# Altium project HIGH_SPEEDV0.PrjPcb
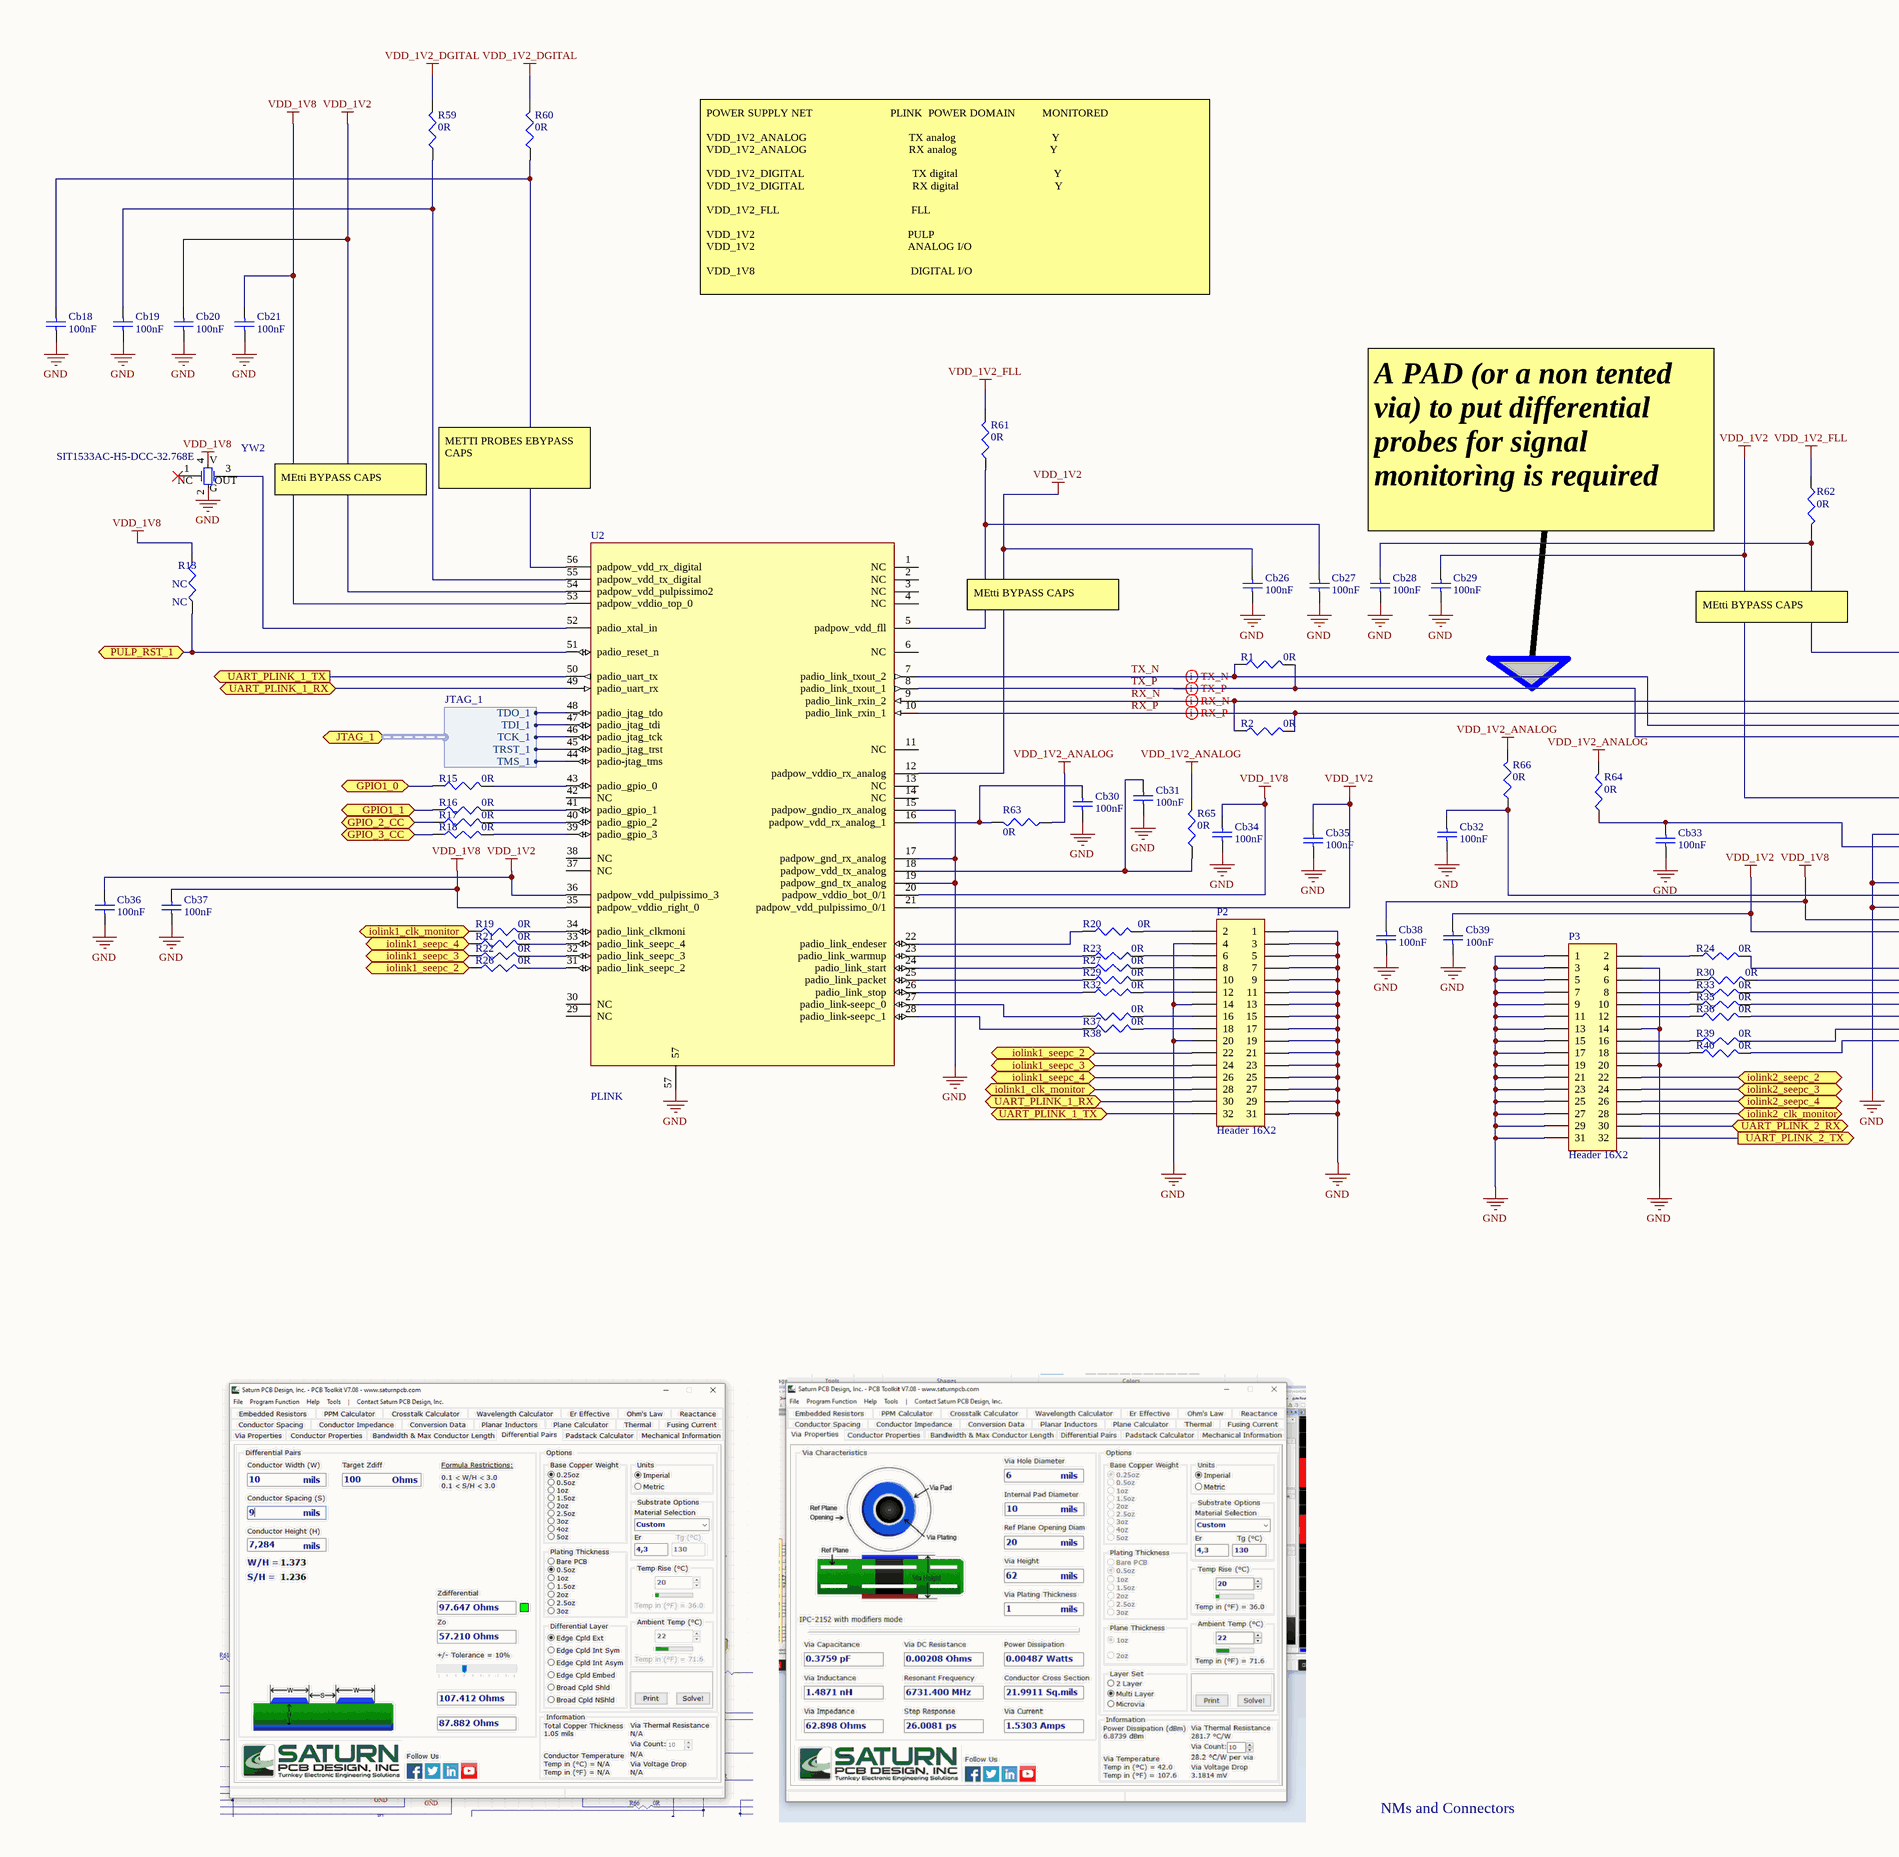
[diagram p0: HIGHSPEED_v0_NM.SchDoc, left]
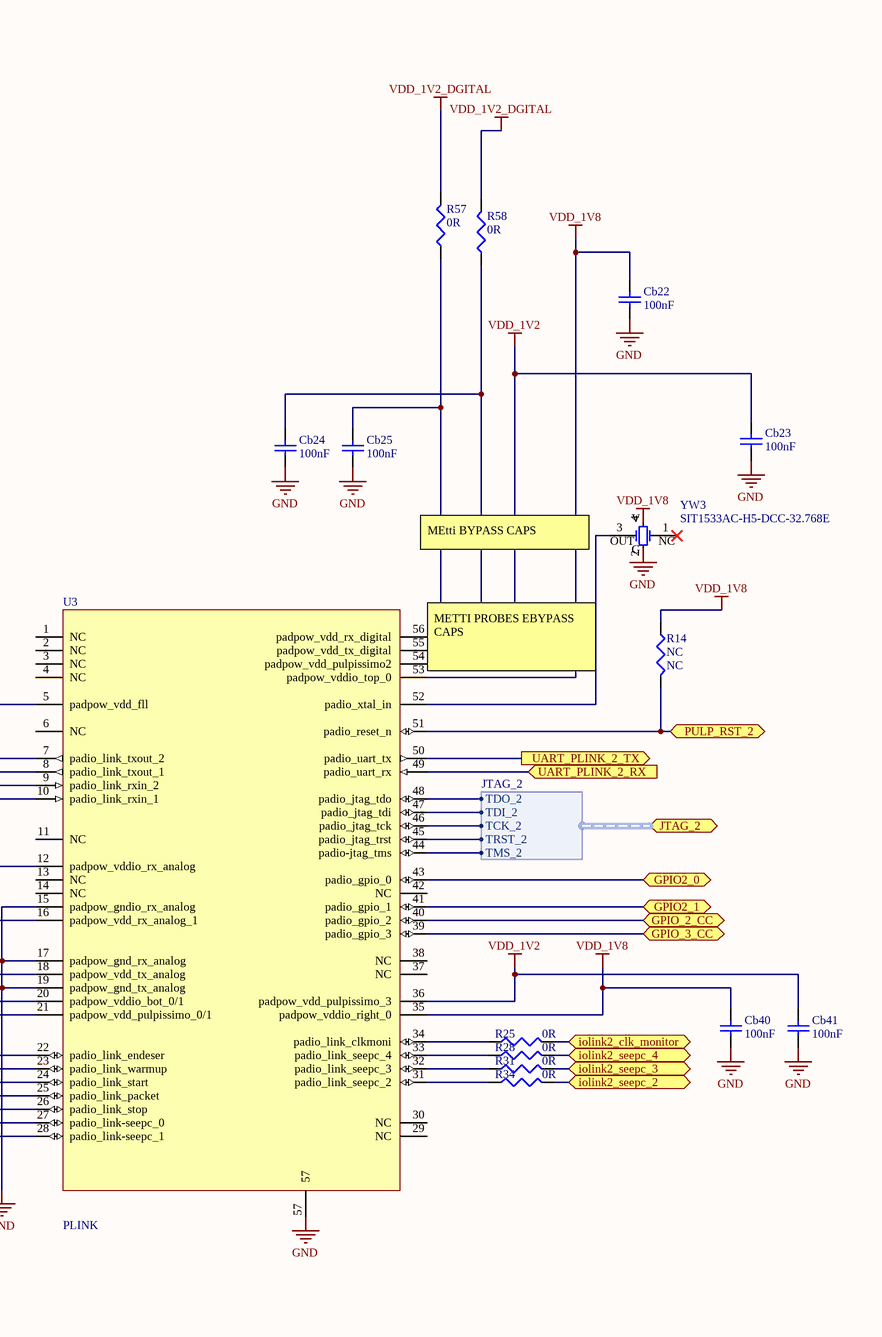
[diagram p1: HIGHSPEED_v0_NM.SchDoc, right]
3 sheets, 160 parts. Net scope: flat (ports and power ports of the same name join across sheets).
Board file: HIGHSPEED_v0.PcbDoc
Sheets:
  HIGHSPEED_v0_NM.SchDoc
  HIGHSPEED_v0_RADIO.SchDoc
  HIGHSPEED_v0_SF2-POWER.SchDoc

## Sheet HIGHSPEED_v0_NM.SchDoc
size A2

### Parts
Cb18  value 100nF  [c0603-Murata-GR]  (hidden comment: GRM187R61A226ME15D)
Cb19  value 100nF  [c0603-Murata-GR]  (hidden comment: GRM187R61A226ME15D)
Cb20  value 100nF  [c0603-Murata-GR]  (hidden comment: GRM187R61A226ME15D)
Cb21  value 100nF  [c0603-Murata-GR]  (hidden comment: GRM187R61A226ME15D)
Cb22  value 100nF  [c0603-Murata-GR]  (hidden comment: GRM187R61A226ME15D)
Cb23  value 100nF  [c0603-Murata-GR]  (hidden comment: GRM187R61A226ME15D)
Cb24  value 100nF  [c0603-Murata-GR]  (hidden comment: GRM187R61A226ME15D)
Cb25  value 100nF  [c0603-Murata-GR]  (hidden comment: GRM187R61A226ME15D)
Cb26  value 100nF  [c0603-Murata-GR]  (hidden comment: GRM187R61A226ME15D)
Cb27  value 100nF  [c0603-Murata-GR]  (hidden comment: GRM187R61A226ME15D)
Cb28  value 100nF  [c0603-Murata-GR]  (hidden comment: GRM187R61A226ME15D)
Cb29  value 100nF  [c0603-Murata-GR]  (hidden comment: GRM187R61A226ME15D)
Cb30  value 100nF  [c0603-Murata-GR]  (hidden comment: GRM187R61A226ME15D)
Cb31  value 100nF  [c0603-Murata-GR]  (hidden comment: GRM187R61A226ME15D)
Cb32  value 100nF  [c0603-Murata-GR]  (hidden comment: GRM187R61A226ME15D)
Cb33  value 100nF  [c0603-Murata-GR]  (hidden comment: GRM187R61A226ME15D)
Cb34  value 100nF  [c0603-Murata-GR]  (hidden comment: GRM187R61A226ME15D)
Cb35  value 100nF  [c0603-Murata-GR]  (hidden comment: GRM187R61A226ME15D)
Cb36  value 100nF  [c0603-Murata-GR]  (hidden comment: GRM187R61A226ME15D)
Cb37  value 100nF  [c0603-Murata-GR]  (hidden comment: GRM187R61A226ME15D)
Cb38  value 100nF  [c0603-Murata-GR]  (hidden comment: GRM187R61A226ME15D)
Cb39  value 100nF  [c0603-Murata-GR]  (hidden comment: GRM187R61A226ME15D)
Cb40  value 100nF  [c0603-Murata-GR]  (hidden comment: GRM187R61A226ME15D)
Cb41  value 100nF  [c0603-Murata-GR]  (hidden comment: GRM187R61A226ME15D)
P2  Header 16X2  [HDR2X16]
P3  Header 16X2  [HDR2X16]
R1  0R  [J1-0603]
R2  0R  [J1-0603]
R13  NC  [0402]
R14  NC  [0402]
R15  0R  [0402]
R16  0R  [0402]
R17  0R  [0402]
R18  0R  [0402]
R19  0R  [0402]
R20  0R  [0402]
R21  0R  [0402]
R22  0R  [0402]
R23  0R  [0402]
R24  0R  [0402]
R25  0R  [0402]
R26  0R  [0402]
R27  0R  [0402]
R28  0R  [0402]
R29  0R  [0402]
R30  0R  [0402]
R31  0R  [0402]
R32  0R  [0402]
R33  0R  [0402]
R34  0R  [0402]
R35  0R  [0402]
R36  0R  [0402]
R37  0R  [0402]
R38  0R  [0402]
R39  0R  [0402]
R40  0R  [0402]
R57  0R  [C1206]
R58  0R  [C1206]
R59  0R  [C1206]
R60  0R  [C1206]
R61  0R  [C1206]
R62  0R  [C1206]
R63  0R  [C1206]
R64  0R  [C1206]
R65  0R  [C1206]
R66  0R  [C1206]
U2  PLINK  [QFN56_M]
U3  PLINK  [QFN56_M]
YW2  SIT1533AC-H5-DCC-32.768E  [SiT1533-C]
YW3  SIT1533AC-H5-DCC-32.768E  [SiT1533-C]

### Ports
GPIO1_0 (bidir), GPIO1_1 (bidir), GPIO2_0 (bidir), GPIO2_1 (bidir), GPIO_2_CC (bidir), GPIO_3_CC (bidir), iolink1_clk_monitor (bidir), iolink1_seepc_2 (bidir), iolink1_seepc_3 (bidir), iolink1_seepc_4 (bidir), iolink2_clk_monitor (bidir), iolink2_seepc_2 (bidir), iolink2_seepc_3 (bidir), iolink2_seepc_4 (bidir), JTAG_1 (harness JTAG_1), JTAG_2 (harness JTAG_2), PULP_RST_1 (bidir), PULP_RST_2 (bidir), UART_PLINK_1_RX (bidir), UART_PLINK_1_TX, UART_PLINK_1_TX (out), UART_PLINK_2_RX, UART_PLINK_2_RX (in), UART_PLINK_2_TX (out)

### Harnesses
JTAG_1: TCK_1, TDI_1, TDO_1, TMS_1, TRST_1
JTAG_2: TCK_2, TDI_2, TDO_2, TMS_2, TRST_2

### Nets
GND: Cb18.1 Cb19.1 Cb20.1 Cb21.1 Cb22.1 Cb23.1 Cb24.1 Cb25.1 Cb26.1 Cb27.1 Cb28.1 Cb29.1 Cb30.1 Cb31.1 Cb32.1 Cb33.1 Cb34.1 Cb35.1 Cb36.1 Cb37.1 Cb38.1 Cb39.1 Cb40.1 Cb41.1 P2.1 P2.3 P2.4 P2.5 P2.7 P2.9 P2.11 P2.13 P2.14 P2.15 P2.17 P2.19 P2.20 P2.21 P2.23 P2.25 P2.27 P2.29 P2.31 P3.1 P3.3 P3.4 P3.5 P3.7 P3.9 P3.11 P3.13 P3.14 P3.15 P3.17 P3.19 P3.20 P3.21 P3.23 P3.25 P3.27 P3.29 P3.31 U2.15(padpow_gndio_rx_analog) U2.17(padpow_gnd_rx_analog) U2.19(padpow_gnd_tx_analog) U2.57 U3.15(padpow_gndio_rx_analog) U3.17(padpow_gnd_rx_analog) U3.19(padpow_gnd_tx_analog) U3.57 YW2.2(GND) YW3.2(GND)
VDD_1V2: Cb20.2 Cb23.2 Cb26.2 Cb29.2 Cb35.2 Cb36.2 Cb39.2 Cb41.2 U2.12(padpow_vddio_rx_analog) U2.21(padpow_vdd_pulpissimo_0/1) U2.36(padpow_vdd_pulpissimo_3) U2.54(padpow_vdd_pulpissimo2) U3.12(padpow_vddio_rx_analog) U3.21(padpow_vdd_pulpissimo_0/1) U3.36(padpow_vdd_pulpissimo_3) U3.54(padpow_vdd_pulpissimo2)
VDD_1V2_ANALOG: R63.2 R64.1 R65.1 R66.1
VDD_1V2_DGITAL: R57.1 R58.1 R59.1 R60.1
VDD_1V2_FLL: R61.1 R62.2
VDD_1V8: Cb21.2 Cb22.2 Cb34.2 Cb37.2 Cb38.2 Cb40.2 R13.2 R14.2 U2.20(padpow_vddio_bot_0/1) U2.35(padpow_vddio_right_0) U2.53(padpow_vddio_top_0) U3.20(padpow_vddio_bot_0/1) U3.35(padpow_vddio_right_0) U3.53(padpow_vddio_top_0) YW2.4(VDD) YW3.4(VDD)
RX_N: R2.2 U2.9(padio_link_rxin_2) U3.7(padio_link_txout_2)
RX_P: R2.1 U2.10(padio_link_rxin_1) U3.8(padio_link_txout_1)
TX_N: R1.2 U2.7(padio_link_txout_2) U3.9(padio_link_rxin_2)
TX_P: R1.1 U2.8(padio_link_txout_1) U3.10(padio_link_rxin_1)
NetCb18_2: Cb18.2 R60.2 U2.56(padpow_vdd_rx_digital)
NetCb19_2: Cb19.2 R59.2 U2.55(padpow_vdd_tx_digital)
NetCb24_2: Cb24.2 R58.2 U3.55(padpow_vdd_tx_digital)
NetCb25_2: Cb25.2 R57.2 U3.56(padpow_vdd_rx_digital)
NetCb27_2: Cb27.2 R61.2 U2.5(padpow_vdd_fll)
NetCb28_2: Cb28.2 R62.1 U3.5(padpow_vdd_fll)
NetCb30_2: Cb30.2 R63.1 U2.16(padpow_vdd_rx_analog_1)
NetCb31_2: Cb31.2 R65.2 U2.18(padpow_vdd_tx_analog)
NetCb32_2: Cb32.2 R66.2 U3.18(padpow_vdd_tx_analog)
NetCb33_2: Cb33.2 R64.2 U3.16(padpow_vdd_rx_analog_1)
NetP2_2: P2.2 R20.2
NetP2_6: P2.6 R23.2
NetP2_8: P2.8 R27.2
NetP2_10: P2.10 R29.2
NetP2_12: P2.12 R32.2
NetP2_16: P2.16 R37.2
NetP2_18: P2.18 R38.2
NetP2_22: P2.22 R26.2 ; port iolink1_seepc_2
NetP2_24: P2.24 R22.2 ; port iolink1_seepc_3
NetP2_26: P2.26 R21.2 ; port iolink1_seepc_4
NetP2_28: P2.28 R19.2 ; port iolink1_clk_monitor
NetP2_30: P2.30 U2.49(padio_uart_rx) ; port UART_PLINK_1_RX
NetP2_32: P2.32 U2.50(padio_uart_tx) ; port UART_PLINK_1_TX
NetP3_2: P3.2 R24.2
NetP3_6: P3.6 R30.2
NetP3_8: P3.8 R33.2
NetP3_10: P3.10 R35.2
NetP3_12: P3.12 R36.2
NetP3_16: P3.16 R39.2
NetP3_18: P3.18 R40.2
NetP3_22: P3.22 R34.1 ; port iolink2_seepc_2
NetP3_24: P3.24 R31.1 ; port iolink2_seepc_3
NetP3_26: P3.26 R28.1 ; port iolink2_seepc_4
NetP3_28: P3.28 R25.1 ; port iolink2_clk_monitor
NetP3_30: P3.30 U3.49(padio_uart_rx) ; port UART_PLINK_2_RX
NetP3_32: P3.32 U3.50(padio_uart_tx) ; port UART_PLINK_2_TX
NetR13_1: R13.1 U2.51(padio_reset_n) ; port PULP_RST_1
NetR14_1: R14.1 U3.51(padio_reset_n) ; port PULP_RST_2
NetR15_1: R15.1 U2.43(padio_gpio_0)
NetR15_2: R15.2 ; port GPIO1_0
NetR16_1: R16.1 U2.41(padio_gpio_1)
NetR16_2: R16.2 ; port GPIO1_1
NetR17_1: R17.1 U2.40(padio_gpio_2)
NetR17_2: R17.2 U3.40(padio_gpio_2) ; port GPIO_2_CC
NetR18_1: R18.1 U2.39(padio_gpio_3)
NetR18_2: R18.2 U3.39(padio_gpio_3) ; port GPIO_3_CC
NetR19_1: R19.1 U2.34(padio_link_clkmoni)
NetR20_1: R20.1 U2.22(padio_link_endeser)
NetR21_1: R21.1 U2.33(padio_link_seepc_4)
NetR22_1: R22.1 U2.32(padio_link_seepc_3)
NetR23_1: R23.1 U2.23(padio_link_warmup)
NetR24_1: R24.1 U3.22(padio_link_endeser)
NetR25_2: R25.2 U3.34(padio_link_clkmoni)
NetR26_1: R26.1 U2.31(padio_link_seepc_2)
NetR27_1: R27.1 U2.24(padio_link_start)
NetR28_2: R28.2 U3.33(padio_link_seepc_4)
NetR29_1: R29.1 U2.25(padio_link_packet)
NetR30_1: R30.1 U3.23(padio_link_warmup)
NetR31_2: R31.2 U3.32(padio_link_seepc_3)
NetR32_1: R32.1 U2.26(padio_link_stop)
NetR33_1: R33.1 U3.24(padio_link_start)
NetR34_2: R34.2 U3.31(padio_link_seepc_2)
NetR35_1: R35.1 U3.25(padio_link_packet)
NetR36_1: R36.1 U3.26(padio_link_stop)
NetR37_1: R37.1 U2.27(padio_link-seepc_0)
NetR38_1: R38.1 U2.28(padio_link-seepc_1)
NetR39_1: R39.1 U3.27(padio_link-seepc_0)
NetR40_1: R40.1 U3.28(padio_link-seepc_1)
NetU2_44: U2.44(padio-jtag_tms) ; port JTAG_1.TMS_1
NetU2_45: U2.45(padio_jtag_trst) ; port JTAG_1.TRST_1
NetU2_46: U2.46(padio_jtag_tck) ; port JTAG_1.TCK_1
NetU2_47: U2.47(padio_jtag_tdi) ; port JTAG_1.TDI_1
NetU2_48: U2.48(padio_jtag_tdo) ; port JTAG_1.TDO_1
NetU2_52: U2.52(padio_xtal_in) YW2.3(OUT)
NetU3_41: U3.41(padio_gpio_1) ; port GPIO2_1
NetU3_43: U3.43(padio_gpio_0) ; port GPIO2_0
NetU3_44: U3.44(padio-jtag_tms) ; port JTAG_2.TMS_2
NetU3_45: U3.45(padio_jtag_trst) ; port JTAG_2.TRST_2
NetU3_46: U3.46(padio_jtag_tck) ; port JTAG_2.TCK_2
NetU3_47: U3.47(padio_jtag_tdi) ; port JTAG_2.TDI_2
NetU3_48: U3.48(padio_jtag_tdo) ; port JTAG_2.TDO_2
NetU3_52: U3.52(padio_xtal_in) YW3.3(OUT)

Not connected (* = marked no-connect by the designer): U2 1(NC) 2(NC) 3(NC) 4(NC) 6(NC) 11(NC) 13(NC) 14(NC) 29(NC) 30(NC) 37(NC) 38(NC) 42(NC); U3 1(NC) 2(NC) 3(NC) 4(NC) 6(NC) 11(NC) 13(NC) 14(NC) 29(NC) 30(NC) 37(NC) 38(NC) 42(NC); YW2 1(NC)*; YW3 1(NC)*

### Layout directives
differential pair: RX_N, RX_P, TX_N, TX_P

### Notes on the sheet
- POWER SUPPLY NET                          PLINK  POWER DOMAIN         MONITORED
  VDD_1V2_ANALOG                                  TX analog                                Y
  VDD_1V2_ANALOG                                  RX analog                               Y
  VDD_1V2_DIGITAL                                    TX digital                                Y
  VDD_1V2_DIGITAL                                    RX digital                                Y
  VDD_1V2_FLL                                            FLL
  VDD_1V2                                                   PULP
  VDD_1V2                                                   ANALOG I/O
  VDD_1V8                                                    DIGITAL I/O
- METTI PROBES EBYPASS CAPS
- MEtti BYPASS CAPS
- A PAD (or a non tented via) to put differential probes for signal monitorìng is required
- (near YW3) MEtti BYPASS CAPS
- (near U3) METTI PROBES EBYPASS CAPS
- NMs and Connectors
- (in symbol SIT-OSC32KHZ-SIT1533AC-H5-DCC-32.768) V; G

### Library data of the parts
Cb18-Cb41 = Cap: CAP CER 22UF 10V X5R 0603; Manufacturer: Murata; Note: 10V X5R 20%; Supplier: Digikey; Supplier PN: 490-13243-1-ND; Manufacturer PN: GRM187R61A226ME15D
P2 P3 = Header 16X2: Header, 16-Pin, Dual row; LatestRevisionDate: 17-Jul-2002; LatestRevisionNote: Re-released for DXP Platform.; Publisher: Altium Limited
R1 R2 R13-R40 R57-R66 = Res3: Resistor; Published: 8-Jun-2000; LatestRevisionDate: 29-May-2009; LatestRevisionNote: IPC-7351 Footprint Added.; PackageReference: J1-0603; Publisher: Altium Limited; PackageDescription: Chip Resistor
  R1 R2 R15-R40 R57-R66: Value: 0R
  R13 R14: Value: NC
YW2 YW3 = SIT-OSC32KHZ-SIT1533AC-H5-DCC-32.768: 20 ppm, Ultra-Low Power 32.768 kHz Quartz XTAL Replacement; Current - Supply (max): 1.3uA; ComponentLink1URL: http://www.sitime.com/products/datasheets/sit1533/SiT1533-datasheet.pdf; ComponentLink1Description: Datasheet; Frequency: 32.768kHz; Supplier 1: Digi-Key; Supplier Part Number 1: 1473-1515-2-ND; Supplier 2: Digi-Key; Supplier Part Number 2: 1473-1515-1-ND; Supplier 3: Digi-Key; Supplier Part Number 3: 1473-1515-6-ND; Supplier 4: Digi-Key; Supplier Part Number 4: 1473-1516-2-ND; Supplier 5: Digi-Key; Supplier Part Number 5: 1473-1516-1-ND; Supplier 6: Digi-Key; Supplier Part Number 6: 1473-1516-6-ND; Supplier 7: Digi-Key; Supplier Part Number 7: SIT1533AC-H5-DCC-32.768S-ND; Supplier 8: Digi-Key; Supplier Part Number 8: SIT1533AC-H5-DCC-32.768D-ND

## Sheet HIGHSPEED_v0_RADIO.SchDoc
size A3
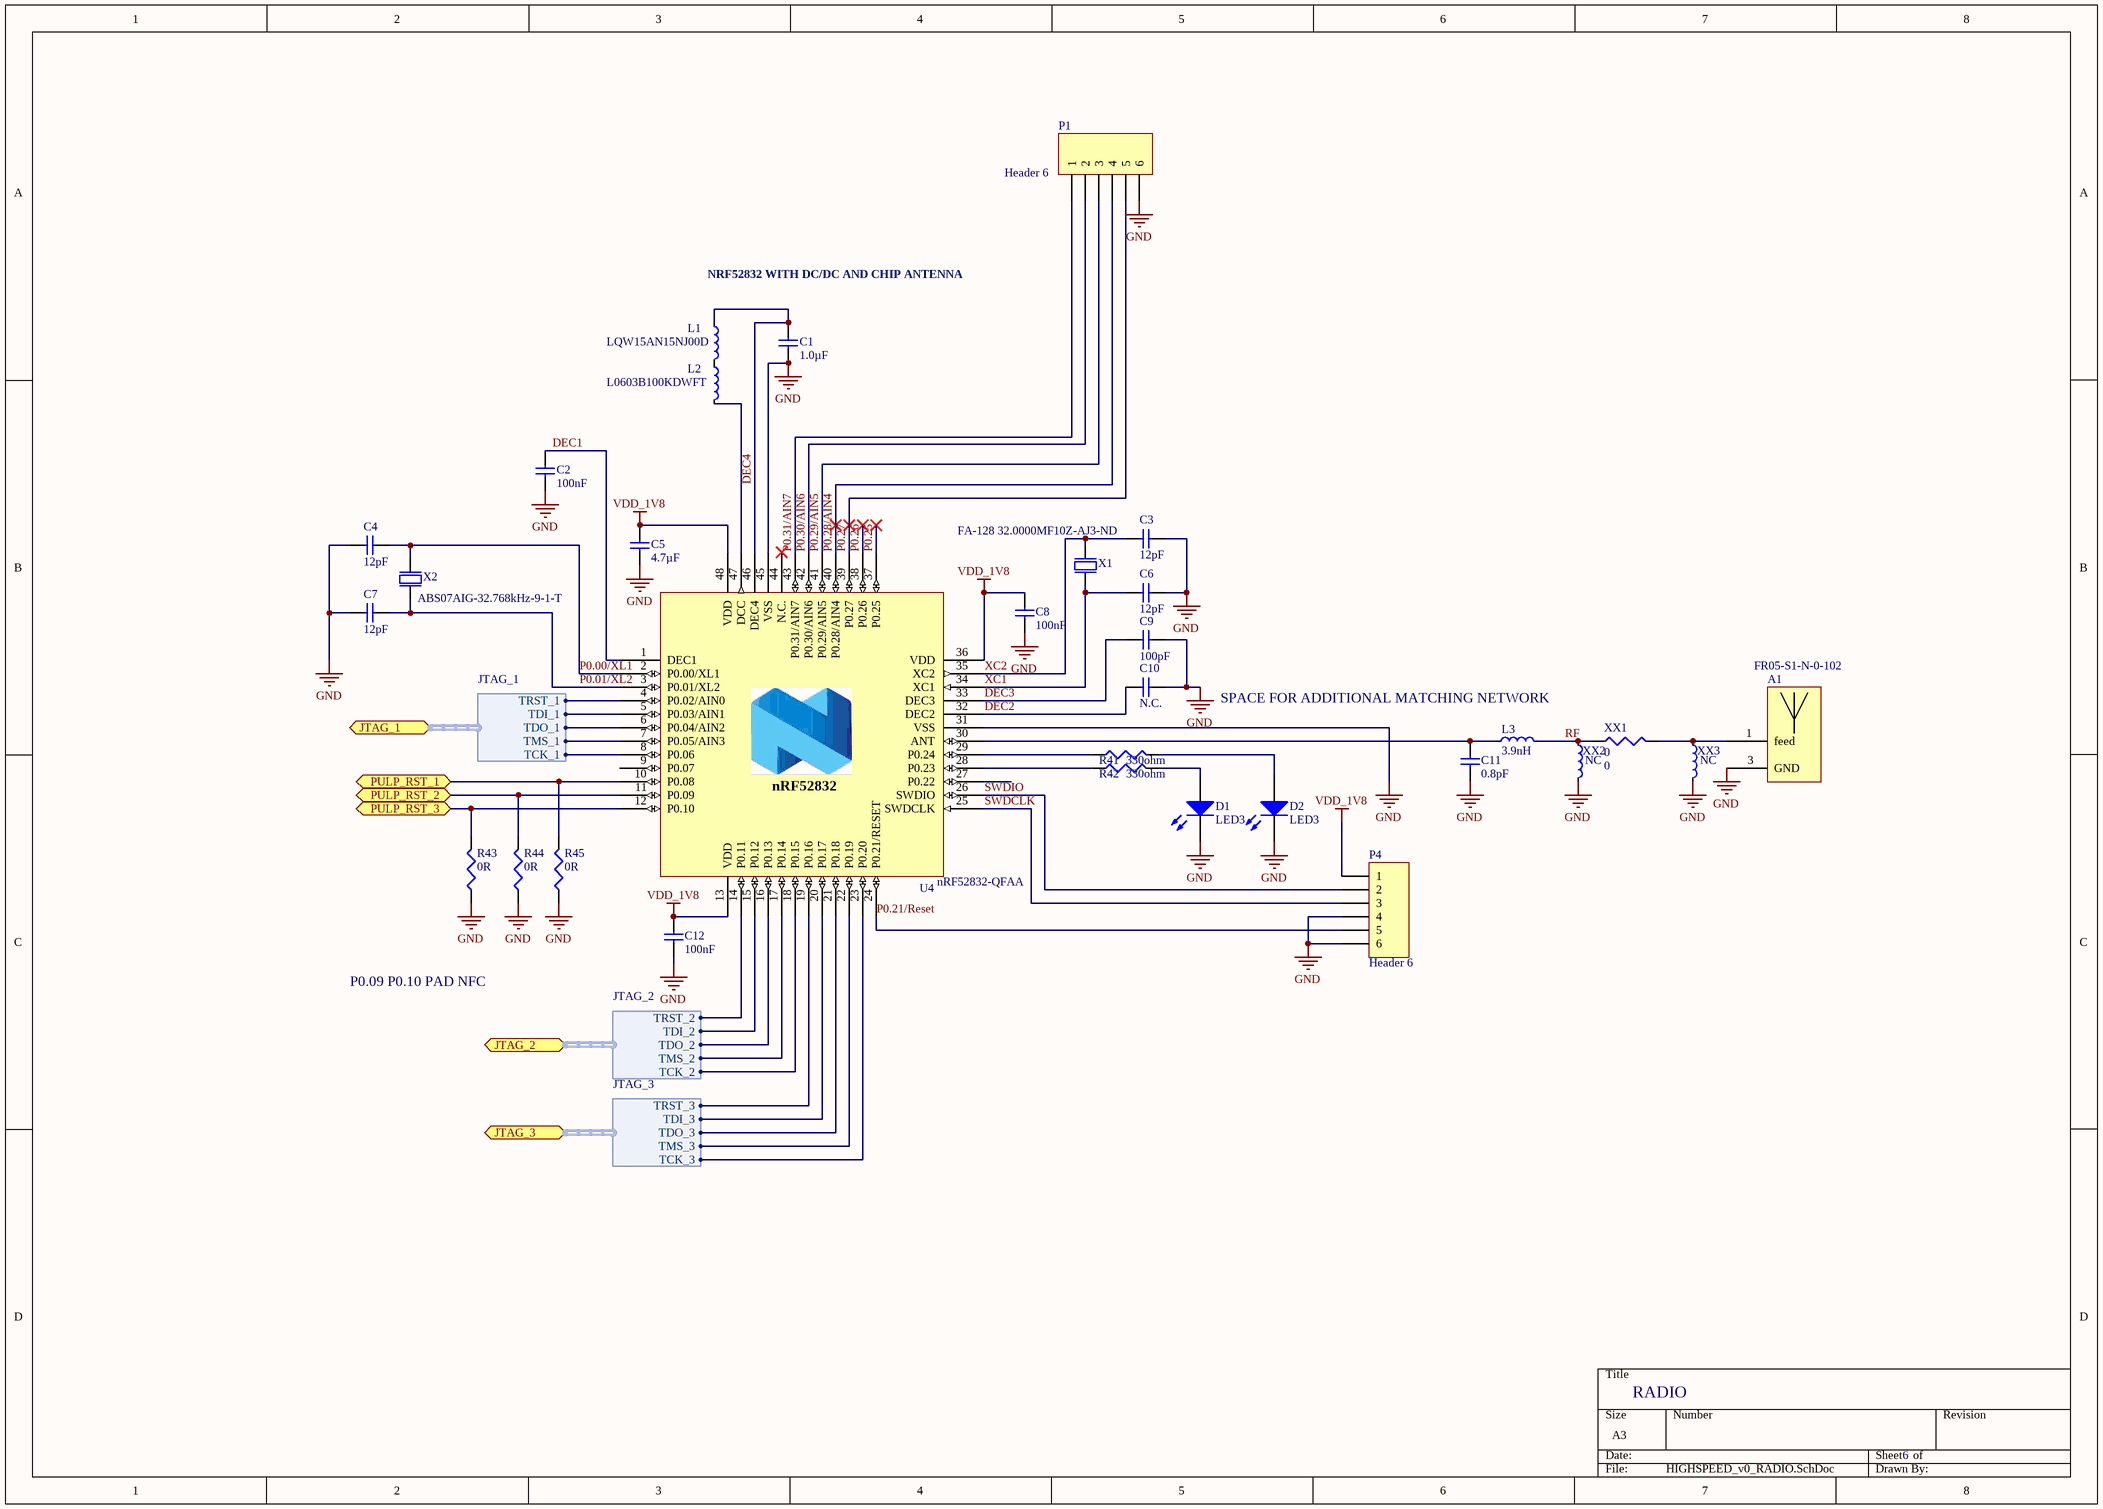
[diagram p2: HIGHSPEED_v0_RADIO.SchDoc]

### Parts
A1  FR05-S1-N-0-102  [ANTENNACHIP]
C1  1.0µF  [CAPC1608X06L]
C2  100nF  [CAPC1005X04L]
C3  12pF  [CAPC1005X04L]
C4  12pF  [CAPC1005X04L]
C5  4.7µF  [CAPC1608X06L]
C6  12pF  [CAPC1005X04L]
C7  12pF  [CAPC1005X04L]
C8  100nF  [CAPC1005X04L]
C9  100pF  [CAPC1005X04L]
C10  N.C.  [CAPC1005X04L]
C11  0.8pF  [CAPC1005X04L]
C12  100nF  [CAPC1005X04L]
D1  LED3  [0603]
D2  LED3  [0603]
L1  LQW15AN15NJ00D  [INDC1005X04L]
L2  L0603B100KDWFT  [J1-0603]
L3  3.9nH  [INDC1005X04L]
P1  Header 6  [HDR1X6]
P4  Header 6  [HDR1X6]
R41  value 330ohm  [res_0402_R - modified]  (hidden comment: Res3)
R42  value 330ohm  [res_0402_R - modified]  (hidden comment: Res3)
R43  0R  [0402]
R44  0R  [0402]
R45  0R  [0402]
U4  nRF52832-QFAA  [QFN40P600X600X90-48N]
X1  FA-128 32.0000MF10Z-AJ3-ND  [BT-XTAL_2016]
X2  ABS07AIG-32.768kHz-9-1-T  [XTAL_3215]
XX1  0  [0402]
XX2  NC  [INDC1005X04L]
XX3  NC  [INDC1005X04L]

### Ports
JTAG_1 (harness JTAG_1), JTAG_2 (harness JTAG_2), JTAG_3 (harness JTAG_3), PULP_RST_1 (bidir), PULP_RST_2 (bidir), PULP_RST_3 (bidir)

### Harnesses
JTAG_1: TRST_1, TDI_1, TDO_1, TMS_1, TCK_1
JTAG_2: TRST_2, TDI_2, TDO_2, TMS_2, TCK_2
JTAG_3: TRST_3, TDI_3, TDO_3, TMS_3, TCK_3

### Nets
GND: A1.3(GND) C1.1 C2.2 C3.2 C4.2 C5.2 C6.2 C7.2 C8.2 C9.2 C10.1 C11.1 C12.2 D1.2(K) D2.2(K) P1.6 P4.4 P4.6 R43.2 R44.2 R45.2 U4.31(VSS) U4.45(VSS) U4.49(GND) X1.2(GND) X1.4(GND) XX2.2 XX3.2
VDD_1V8: C5.1 C8.1 C12.1 P4.1 U4.13(VDD) U4.36(VDD) U4.48(VDD)
DEC1: C2.1 U4.1(DEC1)
DEC2: C10.2 U4.32(DEC2)
DEC3: C9.1 U4.33(DEC3)
DEC4: C1.2 L1.1 U4.46(DEC4)
P0.00/XL1: C4.1 U4.2(P0.00/XL1) X2.1(inp)
P0.01/XL2: C7.1 U4.3(P0.01/XL2) X2.2(out)
P0.21/Reset: P4.5 U4.24(P0.21/RESET)
P0.25: U4.37(P0.25)
P0.26: U4.38(P0.26)
P0.27: P1.5 U4.39(P0.27)
P0.28/AIN4: P1.4 U4.40(P0.28/AIN4)
P0.29/AIN5: P1.3 U4.41(P0.29/AIN5)
P0.30/AIN6: P1.2 U4.42(P0.30/AIN6)
P0.31/AIN7: P1.1 U4.43(P0.31/AIN7)
RF: L3.2 XX1.1 XX2.1
SWDCLK: P4.3 U4.25(SWDCLK)
SWDIO: P4.2 U4.26(SWDIO)
XC1: C6.1 U4.34(XC1) X1.1(inp)
XC2: C3.1 U4.35(XC2) X1.3(out)
NetA1_1: A1.1(feed) XX1.2 XX3.1
NetC11_2: C11.2 L3.1 U4.30(ANT)
NetD1_1: D1.1(A) R42.2
NetD2_1: D2.1(A) R41.2
NetL1_2: L1.2 L2.1
NetL2_2: L2.2 U4.47(DCC)
NetR13_1: R45.1 U4.10(P0.08) ; port PULP_RST_1
NetR14_1: R44.1 U4.11(P0.09) ; port PULP_RST_2
NetR41_1: R41.1 U4.29(P0.24)
NetR42_1: R42.1 U4.28(P0.23)
NetR43_1: R43.1 U4.12(P0.10) ; port PULP_RST_3
NetU2_44: U4.7(P0.05/AIN3) ; port JTAG_1.TMS_1
NetU2_45: U4.4(P0.02/AIN0) ; port JTAG_1.TRST_1
NetU2_46: U4.8(P0.06) ; port JTAG_1.TCK_1
NetU2_47: U4.5(P0.03/AIN1) ; port JTAG_1.TDI_1
NetU2_48: U4.6(P0.04/AIN2) ; port JTAG_1.TDO_1
NetU3_44: U4.17(P0.14) ; port JTAG_2.TMS_2
NetU3_45: U4.14(P0.11) ; port JTAG_2.TRST_2
NetU3_46: U4.18(P0.15) ; port JTAG_2.TCK_2
NetU3_47: U4.15(P0.12) ; port JTAG_2.TDI_2
NetU3_48: U4.16(P0.13) ; port JTAG_2.TDO_2
NetU4_19: U4.19(P0.16) ; port JTAG_3.TRST_3
NetU4_20: U4.20(P0.17) ; port JTAG_3.TDI_3
NetU4_21: U4.21(P0.18) ; port JTAG_3.TDO_3
NetU4_22: U4.22(P0.19) ; port JTAG_3.TMS_3
NetU4_23: U4.23(P0.20) ; port JTAG_3.TCK_3

Not connected (* = marked no-connect by the designer): A1 2(not_connected); U4 9(P0.07) 27(P0.22) 44(N.C.)*

### Notes on the sheet
- NRF52832 WITH DC/DC AND CHIP ANTENNA
- SPACE FOR ADDITIONAL MATCHING NETWORK
- P0.09 P0.10 PAD NFC
- RADIO
- 6
- (in symbol nRF52832-QFAB) nRF52832

### Library data of the parts
A1 = FR05-S1-N-0-102: Bluetooth antenna
C1 = C0603-1µ0: Capacitor, X7R, ±10%; Note: 16V; Artikkelnr Noca: 20039335; Artikkelnr Simpro: N.A.; Part Number: C0603-1µ0; Manufacturer: *; Manufacturer Part Number: *; Datasheet: *; LatestRevisionDate: 2013-06-05; Pin Count: 2; Publisher: Nordic Semiconductor; Published: 2009-05-08; Value: 1.0µF; Supplier: *; Supplier part number: *; 2nd source Supplier: *; 2nd source part number: *; Footprint Doc: 0603
C2 C8 C12 = C0402-100n: Capacitor, X7R, ±10%; Note: 16V; Artikkelnr Noca: 20039200; Artikkelnr Simpro: N.A.; Part Number: C0402-100n; Manufacturer: *; Manufacturer Part Number: *; Datasheet: *; LatestRevisionDate: 2009-11-23; Pin Count: 2; Publisher: Nordic Semiconductor; Published: 2009-05-08; Value: 100nF; Supplier: *; Supplier part number: *; 2nd source Supplier: *; 2nd source part number: *; Footprint Doc: 0402
C3 C4 C6 C7 = C0402-12p: Capacitor, NP0, ±2%; Note: 50V; Artikkelnr Noca: 20029159; Artikkelnr Simpro: N.A.; Part Number: C0402-12p; Manufacturer: *; Manufacturer Part Number: *; Datasheet: *; LatestRevisionDate: 2011-05-11; Pin Count: 2; Publisher: Nordic Semiconductor; Published: 2009-05-08; Value: 12pF; Supplier: *; Supplier part number: *; 2nd source Supplier: *; 2nd source part number: *; Footprint Doc: 0402
C5 = C0603-4µ7: Capacitor, X5R, ±10%; Note: 6.3V; Artikkelnr Noca: 20069060; Artikkelnr Simpro: N.A.; Part Number: C0603-4µ7; Manufacturer: *; Manufacturer Part Number: *; Datasheet: *; LatestRevisionDate: 2009-11-23; Pin Count: 2; Publisher: Nordic Semiconductor; Published: 2009-05-08; Value: 4.7µF; Supplier: *; Supplier part number: *; 2nd source Supplier: *; 2nd source part number: *; Footprint Doc: 0603
C9 = C0402-100p: Capacitor, NP0, ±5%; Note: 50V; Artikkelnr Noca: 20029135; Artikkelnr Simpro: N.A.; Part Number: C0402-100p; Manufacturer: *; Manufacturer Part Number: *; Datasheet: *; LatestRevisionDate: 2009-05-08; Pin Count: 2; Publisher: Nordic Semiconductor; Published: 2009-05-08; Value: 100pF; Supplier: *; Supplier part number: *; 2nd source Supplier: *; 2nd source part number: *; Footprint Doc: 0402
C10 = C0402-N.C.: Not mounted; Note: Chip Cap; Artikkelnr Noca: N.A.; Part Number: C0402-N.C.; Manufacturer: *; Manufacturer Part Number: *; Datasheet: *; LatestRevisionDate: 2009-05-08; Pin Count: 2; Publisher: Nordic Semiconductor; Published: 2009-05-08; Value: N.C.; Supplier: *; Supplier part number: *; 2nd source Supplier: *; 2nd source part number: *; Footprint Doc: 0402; Artikkelnr Simpro: N.A.
C11 = C0402-0.8p: Capacitor, NP0, ±5%; Note: 50V; Artikkelnr Noca: 20029147; Artikkelnr Simpro: N.A.; Part Number: C0402-0.8p; Manufacturer: *; Manufacturer Part Number: *; Datasheet: *; LatestRevisionDate: 2012-11-21; Pin Count: 2; Publisher: Nordic Semiconductor; Published: 2009-05-08; Value: 0.8pF; Supplier: *; Supplier part number: *; 2nd source Supplier: *; 2nd source part number: *; Footprint Doc: 0402
D1 D2 = LED3: Typical BLUE SiC LED; Published: 8-Jun-2000; LatestRevisionDate: 17-Dec-2003; LatestRevisionNote: PCB Footprint replaced.; DatasheetVersion: 16-Apr-2002; PackageVersion: 16-Apr-2002; PackageReference: 3.5X2.8X1.9; Publisher: Altium Limited; PackageDescription: SM LED; 2 C-Bend Leads; Body 3.5 x 2.8 x 1.9 mm, inc leads (LxWxH typ)
L1 = L0402-15n: High frequency chip inductor ±10%; Manufacturer: Taiyo Yuden; Manufacturer Part Number: HK100515NJ-T; 2nd source part number: 658-1328; Value: 15nH; Artikkelnr Noca: 33029323; Artikkelnr Simpro: N.A.; Part Number: L0402-15n; LatestRevisionDate: 2012-09-19; Pin Count: 2; Publisher: Nordic Semiconductor; Published: 2010-07-12; Note: High frequency chip inductor ±10%; Supplier: Digi-Key; Datasheet: http://www.yuden.co.jp/productdata/catalog/en/mlci04_e.pdf; Supplier part number: 587-1521-1-ND; 2nd source Supplier: Farnell; Footprint Doc: 0402
L2 = L0603-10µ: Chip inductor, IDC,min = 50 mA, ±20%; Manufacturer: Taiyo Yuden; Manufacturer Part Number: LBMF1608T100K; 2nd source part number: 178-6105; Value: 10µH; Note: LBMF1608T100K 10µH 80mA 0603; Artikkelnr Noca: 33029314; Artikkelnr Simpro: N.A.; Part Number: L0603-10µ; Datasheet: http://www.yuden.co.jp/ut/product/pdf/elb2_e.pdf; LatestRevisionDate: 2012-09-19; Pin Count: 2; Publisher: Nordic Semiconductor; Published: 2010-02-24; Supplier: Digi-Key; Supplier part number: 587-1714-1-ND; 2nd source Supplier: Farnell; Footprint Doc: 0603
L3 = L0402-3n9: High frequency chip inductor ±5%; Manufacturer: Murata; Manufacturer Part Number: LQP15MN3N9B02D; Artikkelnr Noca: 33029151; Artikkelnr Simpro: N.A.; Part Number: L0402-3n9; Datasheet: http://search.murata.co.jp/Ceramy/image/img/PDF/ENG/L0075S0084LQP15M.pdf; LatestRevisionDate: 2012-09-19; Pin Count: 2; Publisher: Nordic Semiconductor; Published: 2009-05-08; Value: 3.9nH; Note: High frequency chip inductor ±5%; Supplier: Digi-Key; Supplier part number: 490-1131-1-ND; 2nd source Supplier: *; 2nd source part number: *; Footprint Doc: 0402
P1 P4 = Header 6: Header, 6-Pin; LatestRevisionDate: 17-Jul-2002; LatestRevisionNote: Re-released for DXP Platform.; Publisher: Altium Limited
R41-R45 XX1 = Res3: Resistor; Published: 8-Jun-2000; LatestRevisionDate: 29-May-2009; LatestRevisionNote: IPC-7351 Footprint Added.; PackageReference: J1-0603; Publisher: Altium Limited; PackageDescription: Chip Resistor
  R43-R45: Value: 0R
  XX1: Value: 0
U4 = nRF52832-QFAB: Multi-protocol Bluetooth Low Energy, ANT and 2.4GHz proprietary system-on-chip; Manufacturer: Nordic Semiconductor; Artikkelnr Noca: N.A.; Part Number: nRF52832-QFAA; Manufacturer Part Number: nRF52832-QFAA; Datasheet: *; LatestRevisionDate: 2016-11-24; Pin Count: 48; Publisher: Nordic Semiconductor; Published: 2016-11-24; Value: nRF52832-QFAA; Note: *; Supplier: Nordic Semiconductor; Supplier part number: *; 2nd source Supplier: *; 2nd source part number: *; Footprint Doc: QFN-48; Artikkelnr Simpro: N.A.
X1 = XTAL_SMD2016_32MHz_8pF_General: XTAL SMD 2016, 32MHz, Cl=8pF, Total Tol: ±40ppm; Note: XTAL SMD 32.000MHz; Artikkelnr Noca: N.A.; Part Number: XTAL_SMD2016_32MHz_8pF_General; Manufacturer: *; Manufacturer Part Number: *; Datasheet: *; LatestRevisionDate: 2016-08-19; Pin Count: 4; Publisher: Nordic Semiconductor; Published: 2016-08-19; Value: 32MHz; Supplier: *; Supplier part number: *; 2nd source Supplier: *; 2nd source part number: *; Footprint Doc: XTAL_2016; Artikkelnr Simpro: N.A.
X2 = XTAL_SMD3215_32.768kHz_9pF_General: XTAL SMD 3215, 32.768kHz, Cl=9pF, Total Tol: ±50ppm; Note: XTAL SMD 32.768kHz; Artikkelnr Noca: N.A.; Part Number: XTAL_SMD3215_32.768kHz_9pF_General; Manufacturer: *; Manufacturer Part Number: *; Datasheet: *; LatestRevisionDate: 2016-08-19; Pin Count: 2; Publisher: Nordic Semiconductor; Published: 2016-08-19; Value: 32.768kHz; Supplier: *; Supplier part number: *; 2nd source Supplier: *; 2nd source part number: *; Footprint Doc: XTAL_3215; Artikkelnr Simpro: N.A.
XX2 XX3 = L0402-N.C.: Not mounted; Value: N.C.; Artikkelnr Noca: N.A.; Assembly: Not mounted; Part Number: L0402-N.C.; Manufacturer: *; Manufacturer Part Number: *; Datasheet: *; LatestRevisionDate: 2016-11-24; Pin Count: 2; Publisher: Nordic Semiconductor; Published: 2016-11-24; Note: *; Supplier: *; Supplier part number: *; 2nd source Supplier: *; 2nd source part number: *; Footprint Doc: 0402; Artikkelnr Simpro: N.A.; ComponentLink1Description: Datasheet; ComponentLink2Description: Supplier link

## Sheet HIGHSPEED_v0_SF2-POWER.SchDoc
size A3
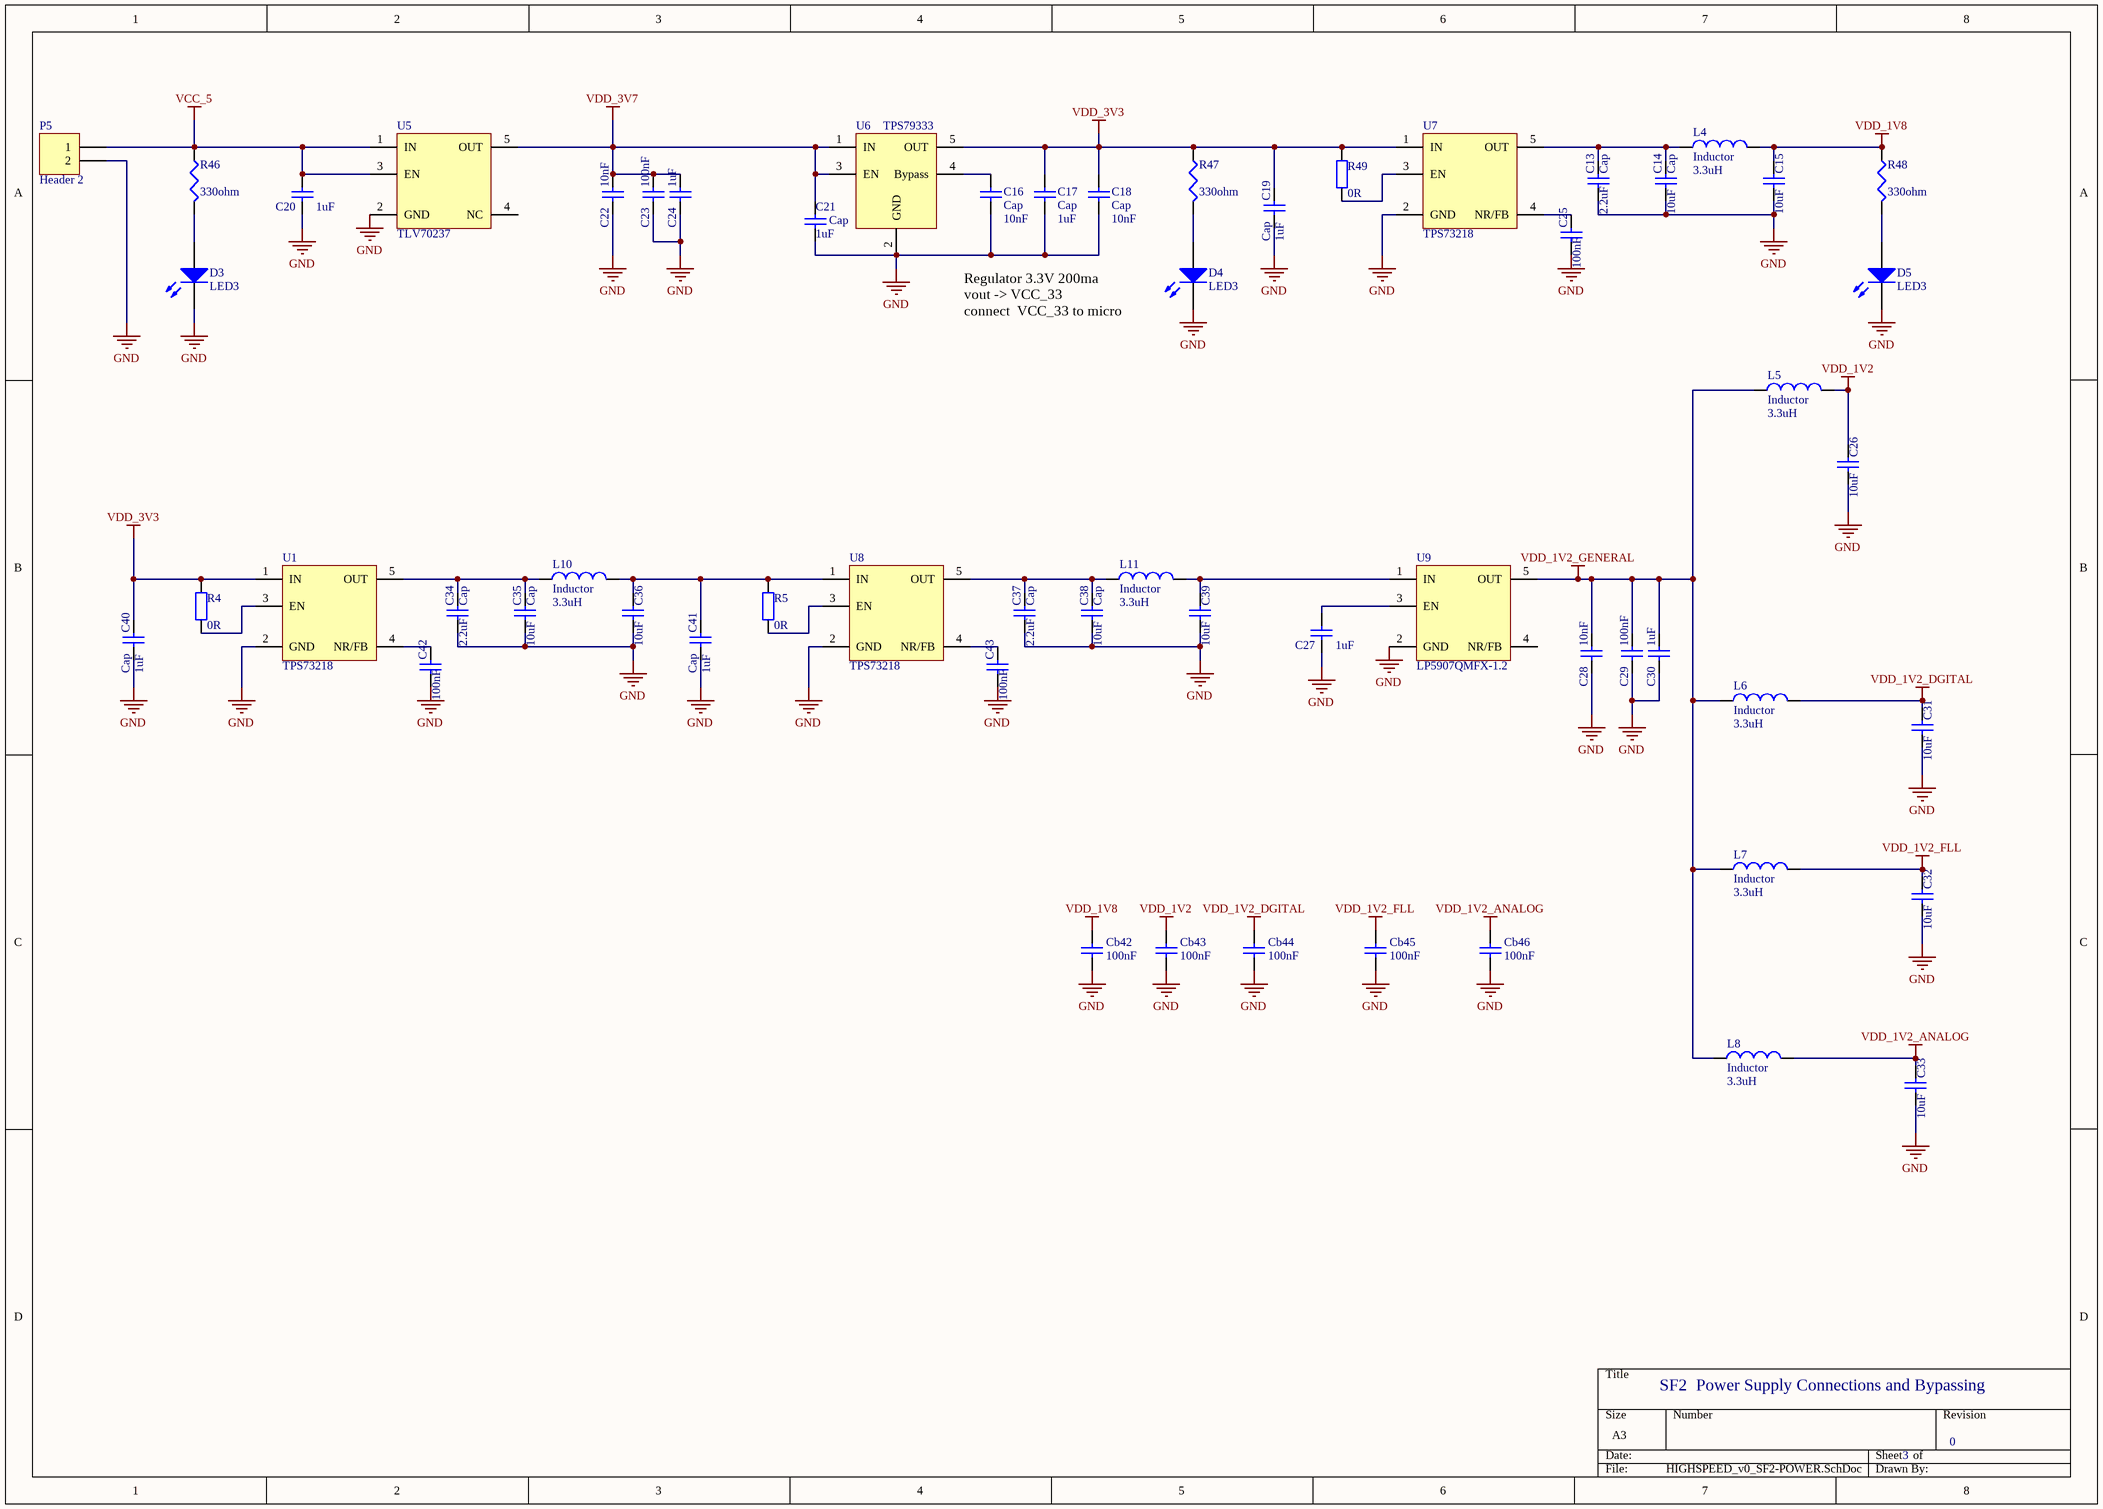
[diagram p3: HIGHSPEED_v0_SF2-POWER.SchDoc]

### Parts
C13  Cap  value 2.2uF  [0603]
C14  Cap  value 10uF  [0603]
C15  value 10uF  [0603]  (hidden comment: Cap)
C16  Cap  value 10nF  [cap_0402_R - modified]
C17  Cap  value 1uF  [cap_0402_R - modified]
C18  Cap  value 10nF  [cap_0402_R - modified]
C19  Cap  value 1uF  [0603]
C20  value 1uF  [1608[0603]]  (hidden comment: Cap Semi)
C21  Cap  value 1uF  [cap_0402_R - modified]
C22  value 10nF  [1608[0603]]  (hidden comment: Cap Semi)
C23  value 100nF  [1608[0603]]  (hidden comment: Cap Semi)
C24  value 1uF  [1608[0603]]  (hidden comment: Cap Semi)
C25  value 100nF  [0603]
C26  value 10uF  [0603]  (hidden comment: Cap)
C27  value 1uF  [1608[0603]]  (hidden comment: Cap Semi)
C28  value 10nF  [1608[0603]]  (hidden comment: Cap Semi)
C29  value 100nF  [1608[0603]]  (hidden comment: Cap Semi)
C30  value 1uF  [1608[0603]]  (hidden comment: Cap Semi)
C31  value 10uF  [0603]  (hidden comment: Cap)
C32  value 10uF  [0603]  (hidden comment: Cap)
C33  value 10uF  [0603]  (hidden comment: Cap)
C34  Cap  value 2.2uF  [0603]
C35  Cap  value 10uF  [0603]
C36  value 10uF  [0603]  (hidden comment: Cap)
C37  Cap  value 2.2uF  [0603]
C38  Cap  value 10uF  [0603]
C39  value 10uF  [0603]  (hidden comment: Cap)
C40  Cap  value 1uF  [0603]
C41  Cap  value 1uF  [0603]
C42  value 100nF  [0603]
C43  value 100nF  [0603]
Cb42  value 100nF  [c0603-Murata-GR]  (hidden comment: GRM187R61A226ME15D)
Cb43  value 100nF  [c0603-Murata-GR]  (hidden comment: GRM187R61A226ME15D)
Cb44  value 100nF  [c0603-Murata-GR]  (hidden comment: GRM187R61A226ME15D)
Cb45  value 100nF  [c0603-Murata-GR]  (hidden comment: GRM187R61A226ME15D)
Cb46  value 100nF  [c0603-Murata-GR]  (hidden comment: GRM187R61A226ME15D)
D3  LED3  [0603]
D4  LED3  [0603]
D5  LED3  [0603]
L4  Inductor  value 3.3uH  [1608[0603]]
L5  Inductor  value 3.3uH  [1608[0603]]
L6  Inductor  value 3.3uH  [1608[0603]]
L7  Inductor  value 3.3uH  [1608[0603]]
L8  Inductor  value 3.3uH  [1608[0603]]
L10  Inductor  value 3.3uH  [1608[0603]]
L11  Inductor  value 3.3uH  [1608[0603]]
P5  Header 2  [HDR1X2]
R4  value 0R  [0603]
R5  value 0R  [0603]
R46  value 330ohm  [res_0402_R - modified]  (hidden comment: Res3)
R47  value 330ohm  [res_0402_R - modified]  (hidden comment: Res3)
R48  value 330ohm  [res_0402_R - modified]  (hidden comment: Res3)
R49  value 0R  [0603]
U1  TPS73218  [SOT23__DDC__(R - PDSO-  G5)]
U5  TLV70237  [SOT23__DDC__(R - PDSO-  G5)]
U6  TPS79333  [SOT_23__DBV_(R - PDSO - G5)]
U7  TPS73218  [SOT23__DDC__(R - PDSO-  G5)]
U8  TPS73218  [SOT23__DDC__(R - PDSO-  G5)]
U9  LP5907QMFX-1.2  [SOT23__DDC__(R - PDSO-  G5)]

### Nets
GND: C13.2 C14.2 C15.2 C16.1 C17.2 C18.1 C19.2 C20.1 C21.1 C22.1 C23.1 C24.1 C25.2 C26.2 C27.1 C28.1 C29.1 C30.1 C31.2 C32.2 C33.2 C34.2 C35.2 C36.2 C37.2 C38.2 C39.2 C40.2 C41.2 C42.2 C43.2 Cb42.1 Cb43.1 Cb44.1 Cb45.1 Cb46.1 D3.2(K) D4.2(K) D5.2(K) P5.2 U1.2(GND) U5.2(GND) U6.2(GND) U7.2(GND) U8.2(GND) U9.2(GND)
VCC_5: C20.2 P5.1 R46.1 U5.1(IN) U5.3(EN)
VDD_1V2: C26.1 Cb43.2 L5.2
VDD_1V2_ANALOG: C33.1 Cb46.2 L8.2
VDD_1V2_DGITAL: C31.1 Cb44.2 L6.2
VDD_1V2_FLL: C32.1 Cb45.2 L7.2
VDD_1V2_GENERAL: C28.2 C29.2 C30.2 L5.1 L6.1 L7.1 L8.1 U9.5(OUT)
VDD_1V8: C15.1 Cb42.2 L4.2 R48.1
VDD_3V3: C17.1 C18.2 C19.1 C40.1 R4.2 R47.1 R49.2 U1.1(IN) U6.5(OUT) U7.1(IN)
VDD_3V7: C21.2 C22.2 C23.2 C24.2 U5.5(OUT) U6.1(IN) U6.3(EN)
NetC13_1: C13.1 C14.1 L4.1 U7.5(OUT)
NetC16_2: C16.2 U6.4(Bypass)
NetC25_1: C25.1 U7.4(NR/FB)
NetC27_2: C27.2 U9.3(EN)
NetC34_1: C34.1 C35.1 L10.1 U1.5(OUT)
NetC36_1: C36.1 C41.1 L10.2 R5.2 U8.1(IN)
NetC37_1: C37.1 C38.1 L11.1 U8.5(OUT)
NetC39_1: C39.1 L11.2 U9.1(IN)
NetC42_1: C42.1 U1.4(NR/FB)
NetC43_1: C43.1 U8.4(NR/FB)
NetD3_1: D3.1(A) R46.2
NetD4_1: D4.1(A) R47.2
NetD5_1: D5.1(A) R48.2
NetR4_1: R4.1 U1.3(EN)
NetR5_1: R5.1 U8.3(EN)
NetR49_1: R49.1 U7.3(EN)

Not connected (* = marked no-connect by the designer): U5 4(NC); U9 4(NR/FB)

### Notes on the sheet
- Regulator 3.3V 200ma
  vout -> VCC_33
  connect  VCC_33 to micro
- SF2  Power Supply Connections and Bypassing
- 3
- 0

### Library data of the parts
C13-C19 C21 C25 C26 C31-C43 = Cap: Capacitor; Published: 8-Jun-2000; LatestRevisionDate: 17-Jul-2002; LatestRevisionNote: Re-released for DXP Platform.; PackageReference: RAD-0.3; Publisher: Altium Limited; PackageDescription: Radial Cap, Thru-Hole; 2 Leads; 0.3 in Pin Spacing; MOUNT: M
C20 C22-C24 C27-C30 = Cap Semi: Capacitor; Published: 8-Jun-2000; LatestRevisionDate: 29-May-2009; LatestRevisionNote: IPC-7351 Footprint Added.; PackageReference: C1206; Publisher: Altium Limited; PackageDescription: Chip Capacitor; MOUNT: M
Cb42-Cb46 = Cap: as Cb18 on sheet HIGHSPEED_v0_NM; Supplier: Digikey; Supplier PN: 490-13243-1-ND; Manufacturer PN: GRM187R61A226ME15D
D3-D5 = LED3: Typical BLUE SiC LED; Published: 8-Jun-2000; LatestRevisionDate: 17-Dec-2003; LatestRevisionNote: PCB Footprint replaced.; DatasheetVersion: 16-Apr-2002; PackageVersion: 16-Apr-2002; PackageReference: 3.5X2.8X1.9; Publisher: Altium Limited; PackageDescription: SM LED; 2 C-Bend Leads; Body 3.5 x 2.8 x 1.9 mm, inc leads (LxWxH typ)
L4-L8 L10 L11 = Inductor: Code_IEC: 1005; Published: 8-Jun-2000; LatestRevisionDate: 29-May-2009; LatestRevisionNote: IPC-7351 Footprint Added.; PackageReference: 0402-A; Publisher: Altium Limited; PackageDescription: Chip Inductor; Code_JEITA: 0402; MOUNT: M
P5 = Header 2: Header, 2-Pin; LatestRevisionDate: 17-Jul-2002; LatestRevisionNote: Re-released for DXP Platform.; Publisher: Altium Limited
R4 R5 R49 = Res2: Resistor; Published: 8-Jun-2000; LatestRevisionDate: 17-Jul-2002; LatestRevisionNote: Re-released for DXP Platform.; PackageReference: AXIAL-0.4; Publisher: Altium Limited; PackageDescription: Axial Device, Thru-Hole; 2 Leads; 0.4 in Pin Spacing; MOUNT: M
R46-R48 = Res3: Resistor; Published: 8-Jun-2000; LatestRevisionDate: 29-May-2009; LatestRevisionNote: IPC-7351 Footprint Added.; PackageReference: J1-0603; Publisher: Altium Limited; PackageDescription: Chip Resistor
U1 U7 U8 = TPS73218: Linear Regulator
U5 = TLV70237: Linear Regulator; MOUNT: M
U6 = TPS79333: Regulator; MOUNT: M
U9 = LP5907QMFX-1.2: Linear Regulator

## Nets that join several sheets
GND: HIGHSPEED_v0_NM (72 pins), HIGHSPEED_v0_RADIO (28 pins), HIGHSPEED_v0_SF2-POWER (46 pins)
VDD_1V2: HIGHSPEED_v0_NM (16 pins), HIGHSPEED_v0_SF2-POWER (C26.1 Cb43.2 L5.2)
VDD_1V2_ANALOG: HIGHSPEED_v0_NM (R63.2 R64.1 R65.1 R66.1), HIGHSPEED_v0_SF2-POWER (C33.1 Cb46.2 L8.2)
VDD_1V2_DGITAL: HIGHSPEED_v0_NM (R57.1 R58.1 R59.1 R60.1), HIGHSPEED_v0_SF2-POWER (C31.1 Cb44.2 L6.2)
VDD_1V2_FLL: HIGHSPEED_v0_NM (R61.1 R62.2), HIGHSPEED_v0_SF2-POWER (C32.1 Cb45.2 L7.2)
VDD_1V8: HIGHSPEED_v0_NM (16 pins), HIGHSPEED_v0_RADIO (7 pins), HIGHSPEED_v0_SF2-POWER (C15.1 Cb42.2 L4.2 R48.1)
NetR13_1: HIGHSPEED_v0_NM (R13.1 U2.51), HIGHSPEED_v0_RADIO (R45.1 U4.10)
NetR14_1: HIGHSPEED_v0_NM (R14.1 U3.51), HIGHSPEED_v0_RADIO (R44.1 U4.11)
NetU2_44: HIGHSPEED_v0_NM (U2.44), HIGHSPEED_v0_RADIO (U4.7)
NetU2_45: HIGHSPEED_v0_NM (U2.45), HIGHSPEED_v0_RADIO (U4.4)
NetU2_46: HIGHSPEED_v0_NM (U2.46), HIGHSPEED_v0_RADIO (U4.8)
NetU2_47: HIGHSPEED_v0_NM (U2.47), HIGHSPEED_v0_RADIO (U4.5)
NetU2_48: HIGHSPEED_v0_NM (U2.48), HIGHSPEED_v0_RADIO (U4.6)
NetU3_44: HIGHSPEED_v0_NM (U3.44), HIGHSPEED_v0_RADIO (U4.17)
NetU3_45: HIGHSPEED_v0_NM (U3.45), HIGHSPEED_v0_RADIO (U4.14)
NetU3_46: HIGHSPEED_v0_NM (U3.46), HIGHSPEED_v0_RADIO (U4.18)
NetU3_47: HIGHSPEED_v0_NM (U3.47), HIGHSPEED_v0_RADIO (U4.15)
NetU3_48: HIGHSPEED_v0_NM (U3.48), HIGHSPEED_v0_RADIO (U4.16)